# Altium schematic sheet ArDINo TopLevel.SchDoc: document title
size C; ApprovedBy: Vincent Himpe; CheckedBy: Vincent Himpe; Author: Vincent Himpe; CompanyName: STMicroelectronics; DrawnBy: Vincent Himpe; Organization: BCD Application; Address1: 2525 Augustine Drive; Address2: Santa Clara 95054 CA; Address3: USA; Revision: A; Project: Project title; DrawnByContact: +1 (408) 451 8116; DrawnByEmail: vincent.himpe@st.com
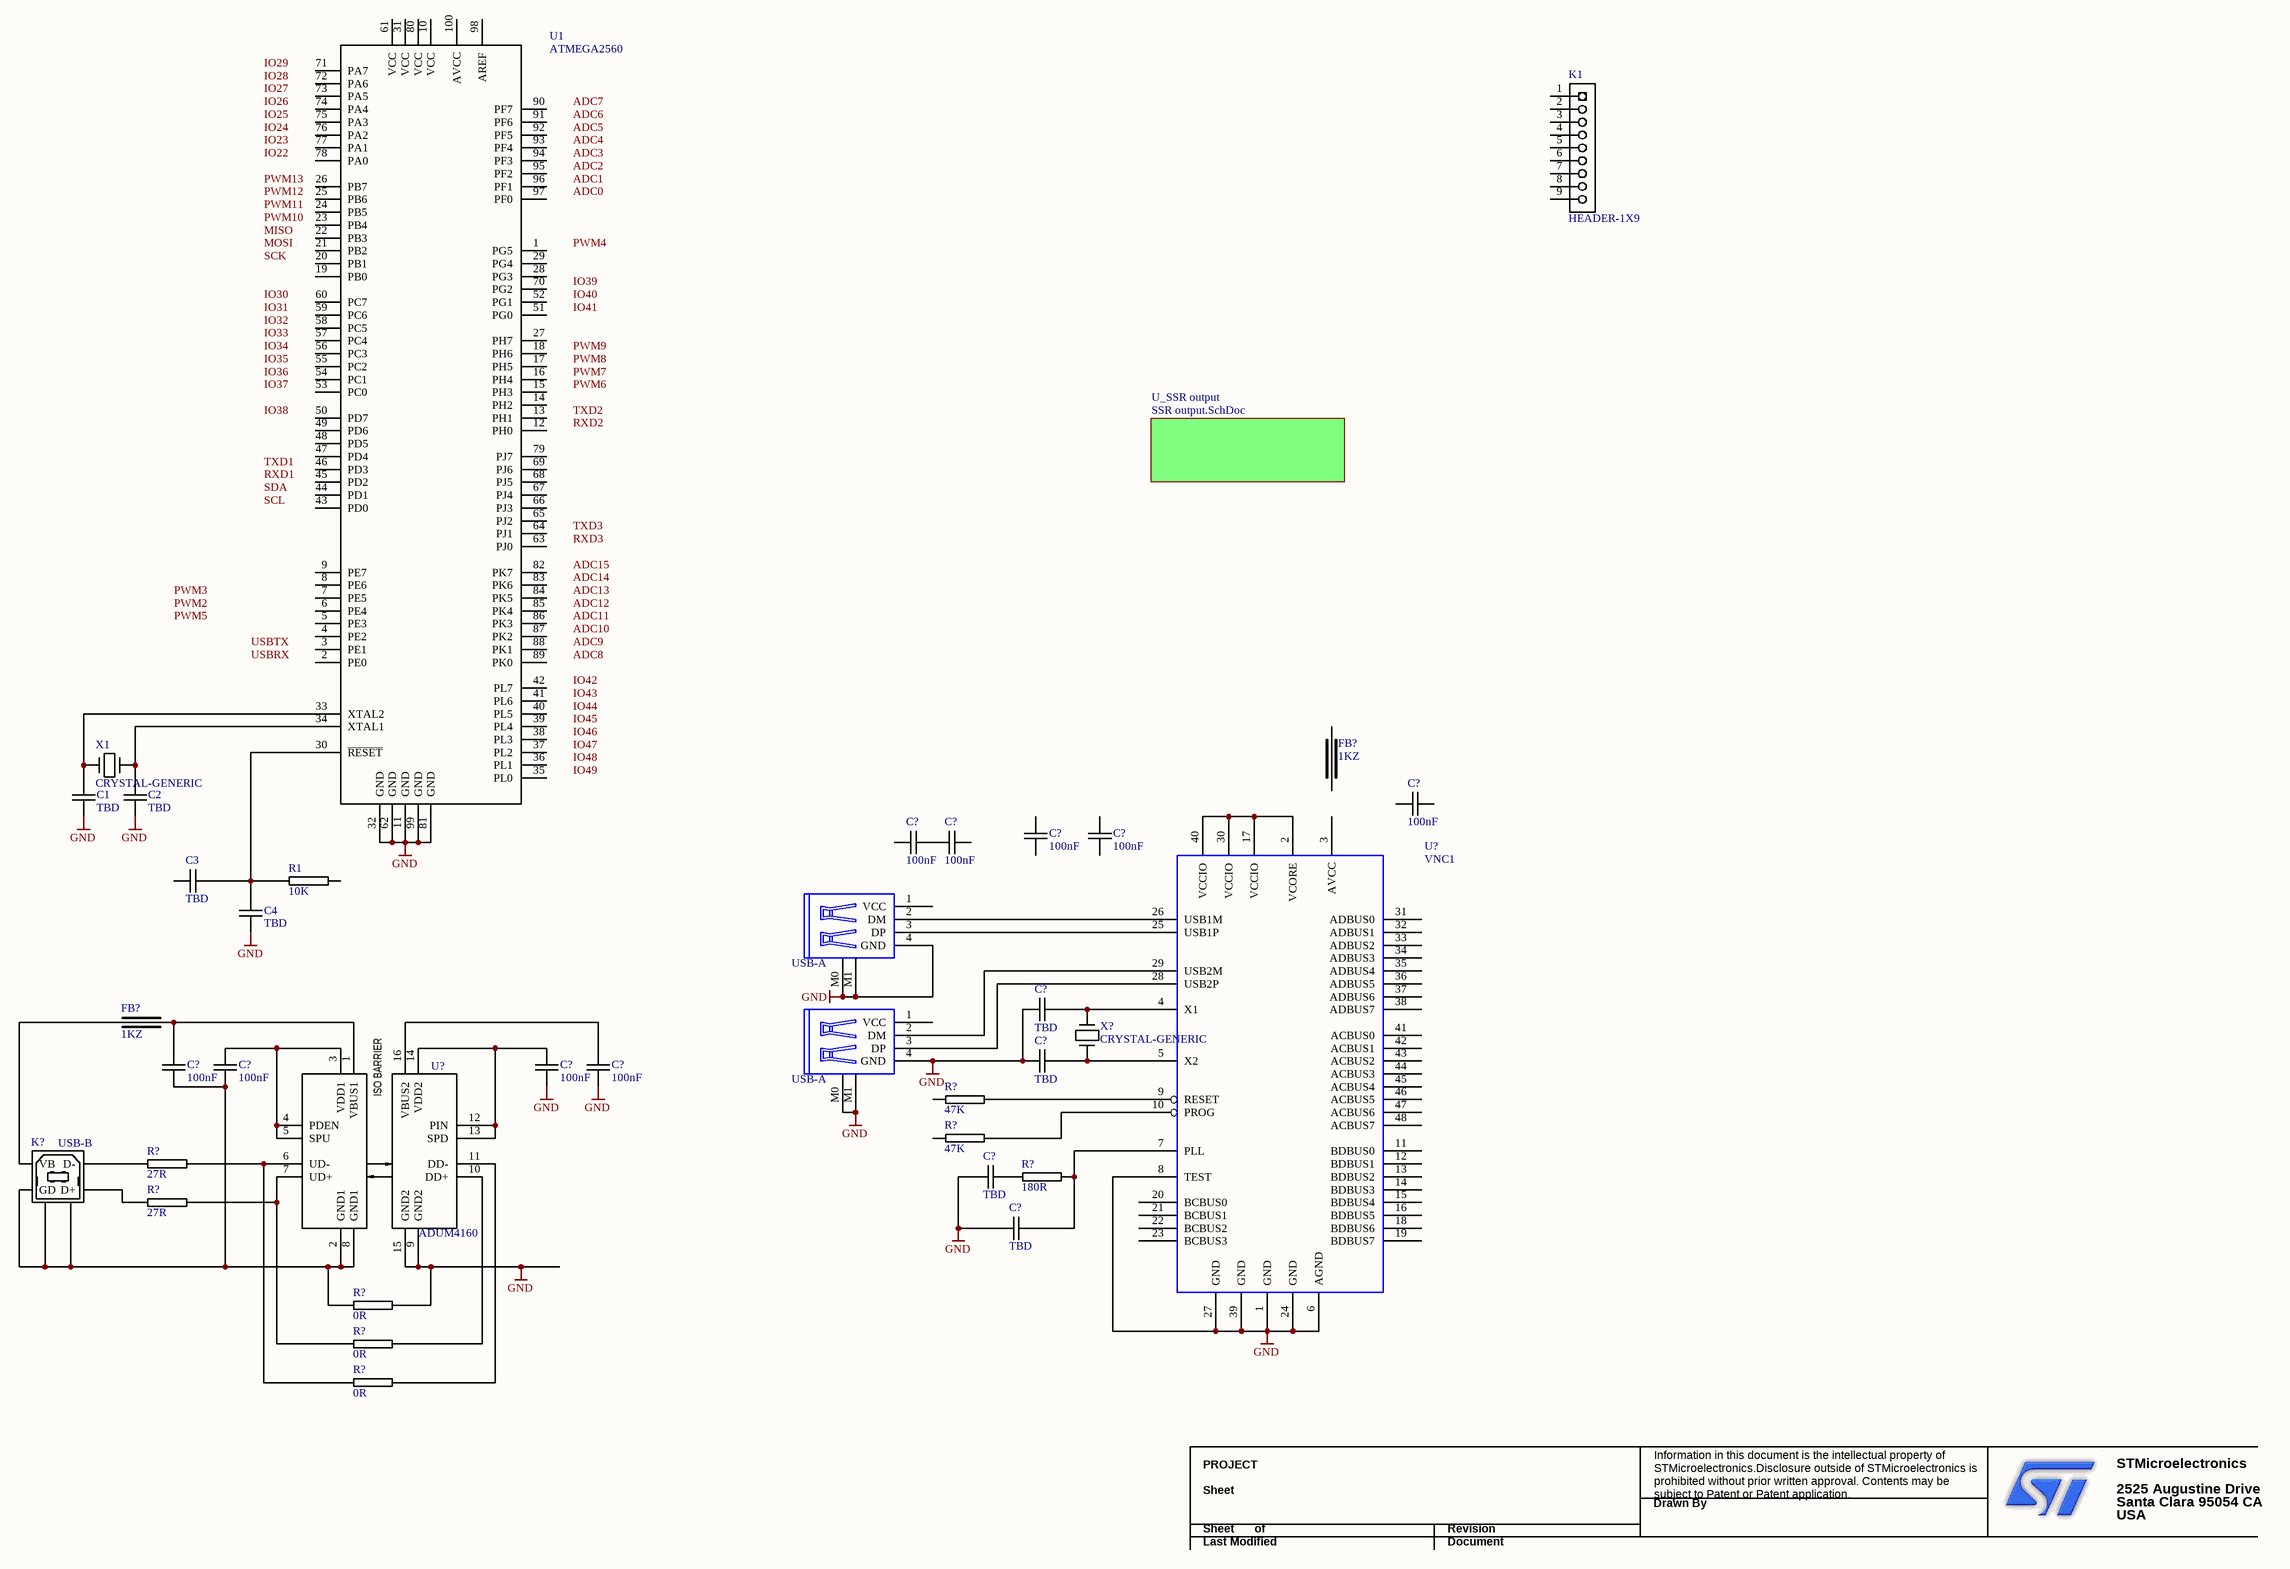
[diagram p0: ArDINo TopLevel.SchDoc]

## Parts
(Parts that share a designator on the sheet are numbered #1, #2 ... from top to bottom, then left to right.)
?#1  USB-A
?#2  USB-A
C1  TBD  [0805C-TBD]
C2  TBD  [0805C-TBD]
C3  TBD  [0805C-TBD]
C4  TBD  [0805C-TBD]
C?#1  100nF  [0805C-TBD]
C?#2  100nF  [0805C-TBD]
C?#3  100nF  [0805C-TBD]
C?#4  100nF  [0805C-TBD]
C?#5  100nF  [0805C-TBD]
C?#6  TBD  [0805C-TBD]
C?#7  100nF  [0805C-TBD]
C?#8  100nF  [0805C-TBD]
C?#9  100nF  [0805C-TBD]
C?#10  100nF  [0805C-TBD]
C?#11  TBD  [0805C-TBD]
C?#12  TBD  [0805C-TBD]
C?#13  TBD  [0805C-TBD]
FB?#1  1KZ  [0805FB-1KZ]
FB?#2  1KZ  [0805FB-1KZ]
K1  HEADER-1X9  [HEADER-1X9]
K?  USB-B  [USB-B]
R1  10K  [0805R-10K]
R?#1  47K  [0805R-47K]
R?#2  47K  [0805R-47K]
R?#3  27R  [0805R-27]
R?#4  180R  [0805R-180]
R?#5  27R  [0805R-27]
R?#6  0R  [0805R-GENERIC]
R?#7  0R  [0805R-GENERIC]
R?#8  0R  [0805R-GENERIC]
U1  ATMEGA2560
U?#1  VNC1  [TQFP48]
U?#2  ADUM4160
X1  CRYSTAL-GENERIC  [XTAL-RU49/4]
X?  CRYSTAL-GENERIC  [XTAL-RU49/4]

## Sub-sheets
U_SSR output = SSR output.SchDoc: no entries

## Nets
GND: ?#1.4(GND) ?#1.M0 ?#1.M1 ?#2.4(GND) ?#2.M0 ?#2.M1 C1.1 C2.1 C4.2 C?#6.1 C?#9.2 C?#10.2 C?#11.1 C?#12.1 C?#13.1 R?#6.2 U1.11(GND) U1.32(GND) U1.62(GND) U1.81(GND) U1.99(GND) U?#1.1(GND) U?#1.6(AGND) U?#1.8(TEST) U?#1.24(GND) U?#1.27(GND) U?#1.39(GND) U?#2.9(GND2) U?#2.15(GND2)
Net?#1_2: ?#1.2(DM) U?#1.26(USB1M)
Net?#1_3: ?#1.3(DP) U?#1.25(USB1P)
Net?#2_2: ?#2.2(DM) U?#1.29(USB2M)
Net?#2_3: ?#2.3(DP) U?#1.28(USB2P)
NetC1_2: C1.2 U1.33(XTAL2) X1.1
NetC2_2: C2.2 U1.34(XTAL1) X1.2
NetC3_2: C3.2 C4.1 R1.2 U1.30(~{RESET})
NetC?#2_1: C?#2.1 C?#3.2
NetC?#6_2: C?#6.2 U?#1.4(X1) X?.1
NetC?#7_1: C?#7.1 FB?#2.2 U?#2.1(VBUS1)
NetC?#7_2: C?#7.2 C?#8.2 K?.4(GD) K?.5 K?.6 R?#6.1 U?#2.2(GND1) U?#2.8(GND1)
NetC?#8_1: C?#8.1 U?#2.3(VDD1) U?#2.4(PDEN) U?#2.5(SPU)
NetC?#9_1: C?#9.1 U?#2.12(PIN) U?#2.13(SPD) U?#2.14(VDD2)
NetC?#10_1: C?#10.1 U?#2.16(VBUS2)
NetC?#11_2: C?#11.2 U?#1.5(X2) X?.2
NetC?#12_2: C?#12.2 R?#4.1
NetC?#13_2: C?#13.2 R?#4.2 U?#1.7(PLL)
NetFB?#2_1: FB?#2.1 K?.1(VB)
NetK?_2: K?.2(D-) R?#3.1
NetK?_3: K?.3(D+) R?#5.1
NetR?#1_2: R?#1.2 U?#1.9(RESET)
NetR?#2_2: R?#2.2 U?#1.10(PROG)
NetR?#3_2: R?#3.2 R?#8.1 U?#2.6(UD-)
NetR?#5_2: R?#5.2 R?#7.1 U?#2.7(UD+)
NetR?#7_2: R?#7.2 U?#2.10(DD+)
NetR?#8_2: R?#8.2 U?#2.11(DD-)
NetU?#1_2: U?#1.2(VCORE) U?#1.17(VCCIO) U?#1.30(VCCIO) U?#1.40(VCCIO)

Not connected (* = marked no-connect by the designer): ?#1 1(VCC); ?#2 1(VCC); C3 1; C?#1 1 2; C?#2 2; C?#3 1; C?#4 1 2; C?#5 1 2; FB?#1 1 2; K1 1 2 3 4 5 6 7 8 9; R1 1; R?#1 1; R?#2 1; U1 1(PG5) 2(PE0) 3(PE1) 4(PE2) 5(PE3) 6(PE4) 7(PE5) 8(PE6) 9(PE7) 10(VCC) 12(PH0) 13(PH1) 14(PH2) 15(PH3) 16(PH4) 17(PH5) 18(PH6) 19(PB0) 20(PB1) 21(PB2) 22(PB3) 23(PB4) 24(PB5) 25(PB6) 26(PB7) 27(PH7) 28(PG3) 29(PG4) 31(VCC) 35(PL0) 36(PL1) 37(PL2) 38(PL3) 39(PL4) 40(PL5) 41(PL6) 42(PL7) 43(PD0) 44(PD1) 45(PD2) 46(PD3) 47(PD4) 48(PD5) 49(PD6) 50(PD7) 51(PG0) 52(PG1) 53(PC0) 54(PC1) 55(PC2) 56(PC3) 57(PC4) 58(PC5) 59(PC6) 60(PC7) 61(VCC) 63(PJ0) 64(PJ1) 65(PJ2) 66(PJ3) 67(PJ4) 68(PJ5) 69(PJ6) 70(PG2) 71(PA7) 72(PA6) 73(PA5) 74(PA4) 75(PA3) 76(PA2) 77(PA1) 78(PA0) 79(PJ7) 80(VCC) 82(PK7) 83(PK6) 84(PK5) 85(PK4) 86(PK3) 87(PK2) 88(PK1) 89(PK0) 90(PF7) 91(PF6) 92(PF5) 93(PF4) 94(PF3) 95(PF2) 96(PF1) 97(PF0) 98(AREF) 100(AVCC); U?#1 3(AVCC) 11(BDBUS0) 12(BDBUS1) 13(BDBUS2) 14(BDBUS3) 15(BDBUS4) 16(BDBUS5) 18(BDBUS6) 19(BDBUS7) 20(BCBUS0) 21(BCBUS1) 22(BCBUS2) 23(BCBUS3) 31(ADBUS0) 32(ADBUS1) 33(ADBUS2) 34(ADBUS3) 35(ADBUS4) 36(ADBUS5) 37(ADBUS6) 38(ADBUS7) 41(ACBUS0) 42(ACBUS1) 43(ACBUS2) 44(ACBUS3) 45(ACBUS4) 46(ACBUS5) 47(ACBUS6) 48(ACBUS7)

## Notes on the sheet
- PROJECT
- STMicroelectronics
- Last Modified
- Sheet
- of
- Document
- Revision
- Drawn By
- Information in this document is the intellectual property of STMicroelectronics.Disclosure outside of STMicroelectronics is prohibited without prior written approval. Contents may be subject to Patent or Patent application.
- 2525 Augustine Drive
- Santa Clara 95054 CA
- USA
- Labels drawn without touching a wire or pin: ADC0, ADC1, ADC2, ADC3, ADC4, ADC5, ADC6, ADC7, ADC8, ADC9, ADC10, ADC11, ADC12, ADC13, ADC14, ADC15, IO22, IO23, IO24, IO25, IO26, IO27, IO28, IO29, IO30, IO31, IO32, IO33, IO34, IO35, IO36, IO37, IO38, IO39, IO40, IO41, IO42, IO43, IO44, IO45, IO46, IO47, IO48, IO49, MISO, MOSI, PWM2, PWM3, PWM4, PWM5, PWM6, PWM7, PWM8, PWM9, PWM10, PWM11, PWM12, PWM13, RXD1, RXD2, RXD3, SCK, SCL, SDA, TXD1, TXD2, TXD3, USBRX, USBTX
- (in symbol ADUM4160) ISO BARRIER

## Library data of the parts
?#1 ?#2 = USB-A: USB A HOST CONNECTOR
C1-C4 C?#6 C?#11-C?#13 = 0805C-TBD: CAPACITOR 0805 CERAMIC VALUE TO BE DETERMINED
C?#1-C?#5 C?#7-C?#10 = 0805C-100nF-25V-X7R-MUR: CAPACITOR 0805 CERAMIC; Supplier 1: Digi-Key; Supplier Part Number 1: 490-1673-1-ND
FB?#1 FB?#2 = 0805FB-1KZ: FERRITE BEAD 1000 OHM 6A; Reel: F3
K? = USB-B: USB B DEVICE CONNECTOR; Text Field1: Assmann; Text Field2: AU-Y1007; Text Field3: Digi-Key; Text Field4: AE1085-ND; Text Field5: Thru-Hole; Text Field6: 1.168; NI?: *; O?: *; Section:: *
R1 = 0805R-10K: RESISTOR 0805 1/4 WATT THIN FILM; Reel: *
R?#1 R?#2 = 0805R-47K: RESISTOR 0805 1/4 WATT THIN FILM
R?#3 R?#5 = 0805R-27: RESISTOR 0805 1/4 WATT THIN FILM; Reel: *
R?#4 = 0805R-180: RESISTOR 0805 1/4 WATT THIN FILM; Reel: *
R?#6-R?#8 = 0805R-0R: RESISTOR 0805 1 WATT
U1 = ATMEGA2560: ATMEL ATMEGA CPU
U?#1 = VNC1: VINCULUM USB HOST CONTROLLER; Manufacturer Part Number: VNC1L-1A-REEL; Manufacturer: FTDI, Future Technology Devices International Ltd; Description: IC USB HOST CTLR VINCULUM 48LQFP; Current - Supply: 25mA; Interface: SPI; Voltage - Supply: 3 V ~ 3.6 V; Controller Type: USB 2.0 Controller; Supplier 1: Digi-Key; Supplier Part Number 1: 768-1000-2-ND; Supplier Part Number: 768-1000-2-ND; RoHS: RoHS Compliant; Supplier: Digi-Key; Category: Integrated Circuits (ICs); Operating Temperature: 0°C ~ 70°C; Packaging: Tape & Reel (TR); Package / Case: 48-LQFP
X1 X? = CRYSTAL-GENERIC: GENERIC CRYSTAL
K1 = HEADER-1X9: Supplier 1: Digi-Key; Supplier Part Number 1: S1011E-36-ND